# Altium schematic sheet ngh-ioctl.SchDoc
size A4
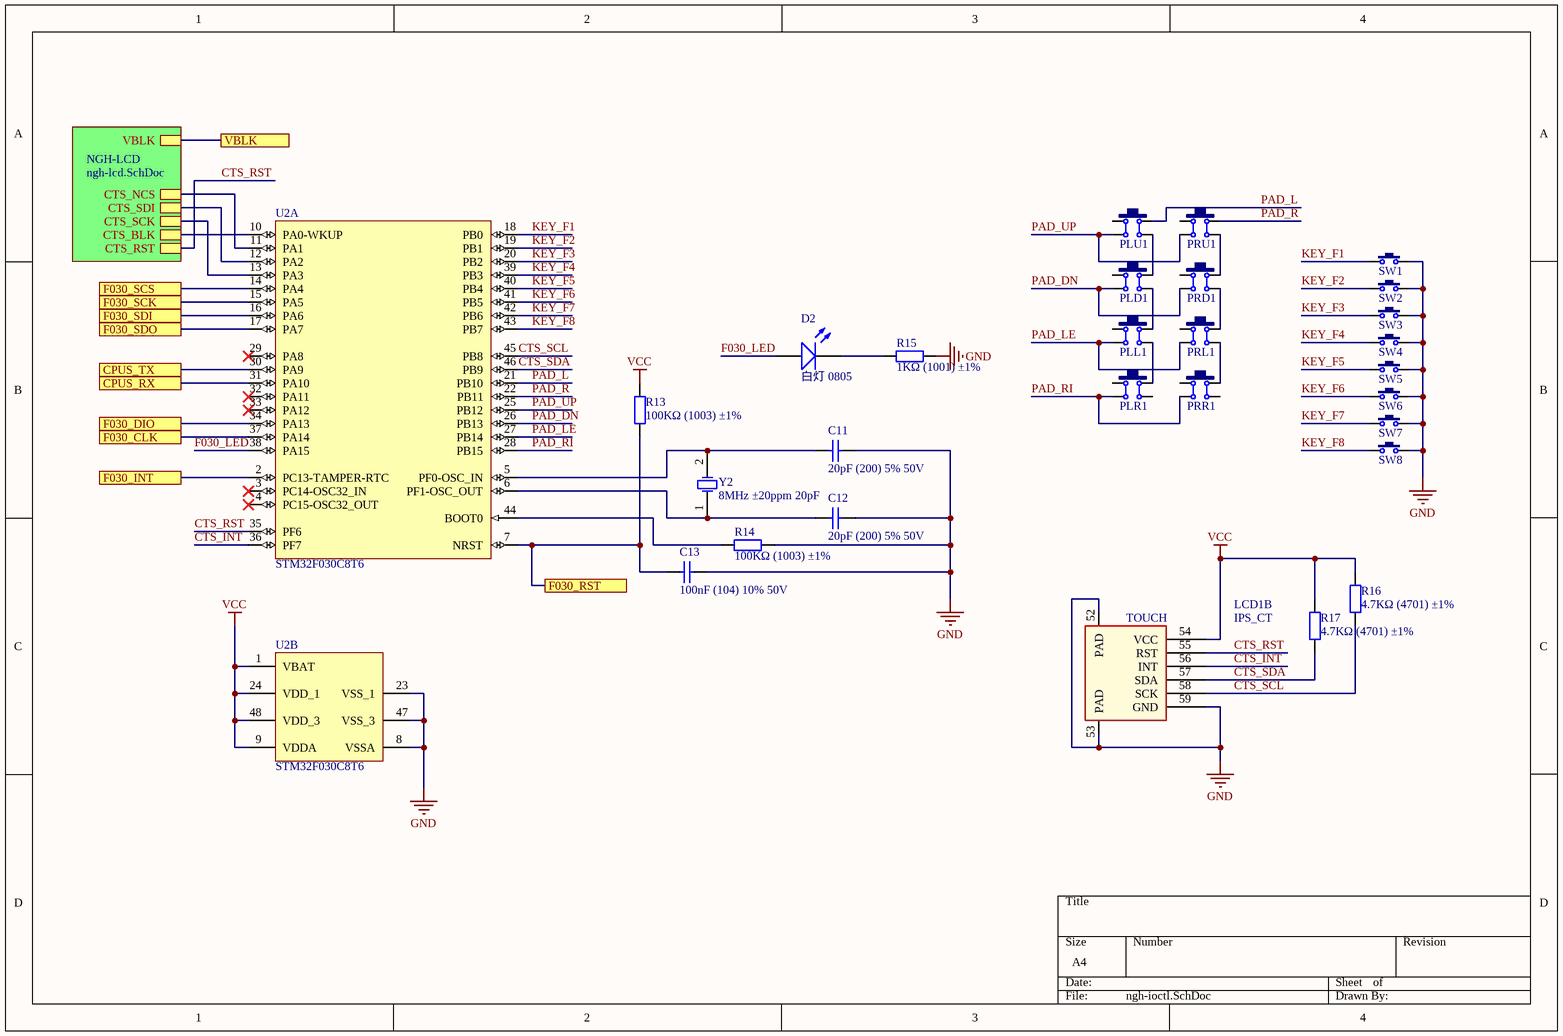
[diagram p0: ngh-ioctl.SchDoc]

## Parts
C11  20pF (200) 5% 50V  [0603_C]
C12  20pF (200) 5% 50V  [0603_C]
C13  100nF (104) 10% 50V  [0603_C]
D2  白灯 0805  [0805_LED_S1]
LCD1  IPS_CT  [IPS_CT]  (part B of 3)
PLD1  12x12x5  [TSW SMD-12*12*6]  (value not drawn)
PLL1  12x12x5  [TSW SMD-12*12*6]  (value not drawn)
PLR1  12x12x5  [TSW SMD-12*12*6]  (value not drawn)
PLU1  12x12x5  [TSW SMD-12*12*6]  (value not drawn)
PRD1  12x12x5  [TSW SMD-12*12*6]  (value not drawn)
PRL1  12x12x5  [TSW SMD-12*12*6]  (value not drawn)
PRR1  12x12x5  [TSW SMD-12*12*6]  (value not drawn)
PRU1  12x12x5  [TSW SMD-12*12*6]  (value not drawn)
R13  100KΩ (1003) ±1%  [0603_R]
R14  100KΩ (1003) ±1%  [0603_R]
R15  1KΩ (1001) ±1%  [0603_R]
R16  4.7KΩ (4701) ±1%  [0603_R]
R17  4.7KΩ (4701) ±1%  [0603_R]
SW1  3x6x5  [TSW SMD-3*6*4.3]  (value not drawn)
SW2  3x6x5  [TSW SMD-3*6*4.3]  (value not drawn)
SW3  3x6x5  [TSW SMD-3*6*4.3]  (value not drawn)
SW4  3x6x5  [TSW SMD-3*6*4.3]  (value not drawn)
SW5  3x6x5  [TSW SMD-3*6*4.3]  (value not drawn)
SW6  3x6x5  [TSW SMD-3*6*4.3]  (value not drawn)
SW7  3x6x5  [TSW SMD-3*6*4.3]  (value not drawn)
SW8  3x6x5  [TSW SMD-3*6*4.3]  (value not drawn)
U2  STM32F030C8T6  [LQFP-48_7x7x05P]  (parts A,B of 2)
Y2  8MHz ±20ppm 20pF  [SMD-5032_2P]

## Sub-sheets
NGH-LCD = ngh-lcd.SchDoc: CTS_BLK, VBLK, CTS_RST, CTS_SDI, CTS_SCK, CTS_NCS

## Ports
CPUS_RX, CPUS_TX, F030_CLK, F030_DIO, F030_INT, F030_RST, F030_SCK, F030_SCS, F030_SDI, F030_SDO, VBLK

## Nets
GND: C11.2 C12.2 C13.1 LCD1.52(PAD) LCD1.53(PAD) LCD1.59(GND) R14.2 R15.2 SW1.2 SW2.2 SW3.2 SW4.2 SW5.2 SW6.2 SW7.2 SW8.2 U2.8(VSSA) U2.23(VSS_1) U2.47(VSS_3)
VCC: LCD1.54(VCC) R13.2 R16.2 R17.2 U2.1(VBAT) U2.9(VDDA) U2.24(VDD_1) U2.48(VDD_3)
CPUS_RX: U2.31(PA10) ; port CPUS_RX
CPUS_TX: U2.30(PA9) ; port CPUS_TX
CTS_INT: LCD1.56(INT) U2.36(PF7)
CTS_RST: LCD1.55(RST) U2.35(PF6) ; sheet NGH-LCD/CTS_RST
CTS_SCL: LCD1.58(SCK) R16.1 U2.45(PB8)
CTS_SDA: LCD1.57(SDA) R17.1 U2.46(PB9)
F030_CLK: U2.37(PA14) ; port F030_CLK
F030_DIO: U2.34(PA13) ; port F030_DIO
F030_INT: U2.2(PC13-TAMPER-RTC) ; port F030_INT
F030_LED: D2.A U2.38(PA15)
F030_RST: C13.2 R13.1 U2.7(NRST) ; port F030_RST
F030_SCK: U2.15(PA5) ; port F030_SCK
F030_SCS: U2.14(PA4) ; port F030_SCS
F030_SDI: U2.16(PA6) ; port F030_SDI
F030_SDO: U2.17(PA7) ; port F030_SDO
KEY_F1: SW1.1 U2.18(PB0)
KEY_F2: SW2.1 U2.19(PB1)
KEY_F3: SW3.1 U2.20(PB2)
KEY_F4: SW4.1 U2.39(PB3)
KEY_F5: SW5.1 U2.40(PB4)
KEY_F6: SW6.1 U2.41(PB5)
KEY_F7: SW7.1 U2.42(PB6)
KEY_F8: SW8.1 U2.43(PB7)
PAD_DN: PLD1.4 PRD1.4 U2.26(PB13)
PAD_L: PLU1.2 U2.21(PB10)
PAD_LE: PLL1.4 PRL1.4 U2.27(PB14)
PAD_R: PRU1.2 U2.22(PB11)
PAD_RI: PLR1.4 PRR1.4 U2.28(PB15)
PAD_UP: PLU1.4 PRU1.4 U2.25(PB12)
VBLK: port VBLK, sheet NGH-LCD/VBLK
NetC11_1: C11.1 U2.5(PF0-OSC_IN) Y2.2(OSC2)
NetC12_1: C12.1 U2.6(PF1-OSC_OUT) Y2.1(OSC1)
NetD2_K: D2.K R15.1
NetPLD1_2: PLD1.2 PLU1.3
NetPLD1_3: PLD1.3 PLL1.2
NetPLL1_3: PLL1.3 PLR1.2
NetPRD1_2: PRD1.2 PRU1.3
NetPRD1_3: PRD1.3 PRL1.2
NetPRL1_3: PRL1.3 PRR1.2
NetR14_1: R14.1 U2.44(BOOT0)
NetU2_10: U2.10(PA0-WKUP) ; sheet NGH-LCD/CTS_BLK
NetU2_11: U2.11(PA1) ; sheet NGH-LCD/CTS_NCS
NetU2_12: U2.12(PA2) ; sheet NGH-LCD/CTS_SDI
NetU2_13: U2.13(PA3) ; sheet NGH-LCD/CTS_SCK

Not connected (* = marked no-connect by the designer): PLD1 1; PLL1 1; PLR1 1 3; PLU1 1; PRD1 1; PRL1 1; PRR1 1 3; PRU1 1; U2 3(PC14-OSC32_IN)* 4(PC15-OSC32_OUT)* 29(PA8)* 32(PA11)* 33(PA12)*

## Notes on the sheet
- (in symbol IPS_CT, part B) TOUCH

## Library data of the parts
C11 C12 = 0603 20pF (200) 5% 50V: 贴片电容; ComponentLink1Description: 供应商链接; ComponentLink1URL: http://www.szlcsc.com/product/details_2000.html; Package: 0603; Supplier: LC; SuppliersPartNumber: C1648
C13 = 0603 100nF (104) 10% 50V: 贴片电容; ComponentLink1Description: 供应商链接; ComponentLink1URL: http://www.szlcsc.com/product/details_15331.html; Package: 0603; Supplier: LC; SuppliersPartNumber: C14663
D2 = 0805 白灯: 发光二极管; ComponentLink1Description: 供应商链接; ComponentLink1URL: http://www.szlcsc.com/product/details_35468.html; Package: 0805; Supplier: LC; SuppliersPartNumber: C34499
PLD1 PLL1 PLR1 PLU1 PRD1 PRL1 PRR1 PRU1 = TSW SMD-12x12: 贴片12x12轻触开关; 版权归属: 源创客; BOM名称: 贴片12x12轻触开关; 学习资源: www.ooocke.com
R13 R14 = 0603 100KΩ (1003) 1%: 贴片电阻; ComponentLink1Description: 供应商链接; ComponentLink1URL: http://www.szlcsc.com/product/details_26546.html; Package: 0603; Supplier: LC; SuppliersPartNumber: C25803
R15 = 0603 1KΩ (1001) 1%: 贴片电阻; ComponentLink1Description: 供应商链接; ComponentLink1URL: http://www.szlcsc.com/product/details_21904.html; Package: 0603; Supplier: LC; SuppliersPartNumber: C21190
R16 R17 = 0603 4.7KΩ (4701) 1%: 贴片电阻; ComponentLink1Description: 供应商链接; ComponentLink1URL: http://www.szlcsc.com/product/details_23889.html; Package: 0603; Supplier: LC; SuppliersPartNumber: C23162
SW1-SW8 = TSW 3x6: 3x6轻触开关; 版权归属: 源创客; BOM名称: 3x6轻触开关; 学习资源: www.ooocke.com
U2 = STM32F030C8T6: ARM; ComponentLink1Description: 供应商链接; ComponentLink1URL: http://www.szlcsc.com/product/details_9243.html; Package: LQFP-48_7x7x05P; Supplier: LC; SuppliersPartNumber: C8734
Y2 = SMD-5032_2P 8MHz 20ppm 20pF: 贴片晶振; ComponentLink1Description: 供应商链接; ComponentLink1URL: http://www.szlcsc.com/product/details_117214.html; Package: SMD-5032_2P; Supplier: LC; SuppliersPartNumber: C115962